# EAGLE design v1.3 (EAGLE 9.4.2)
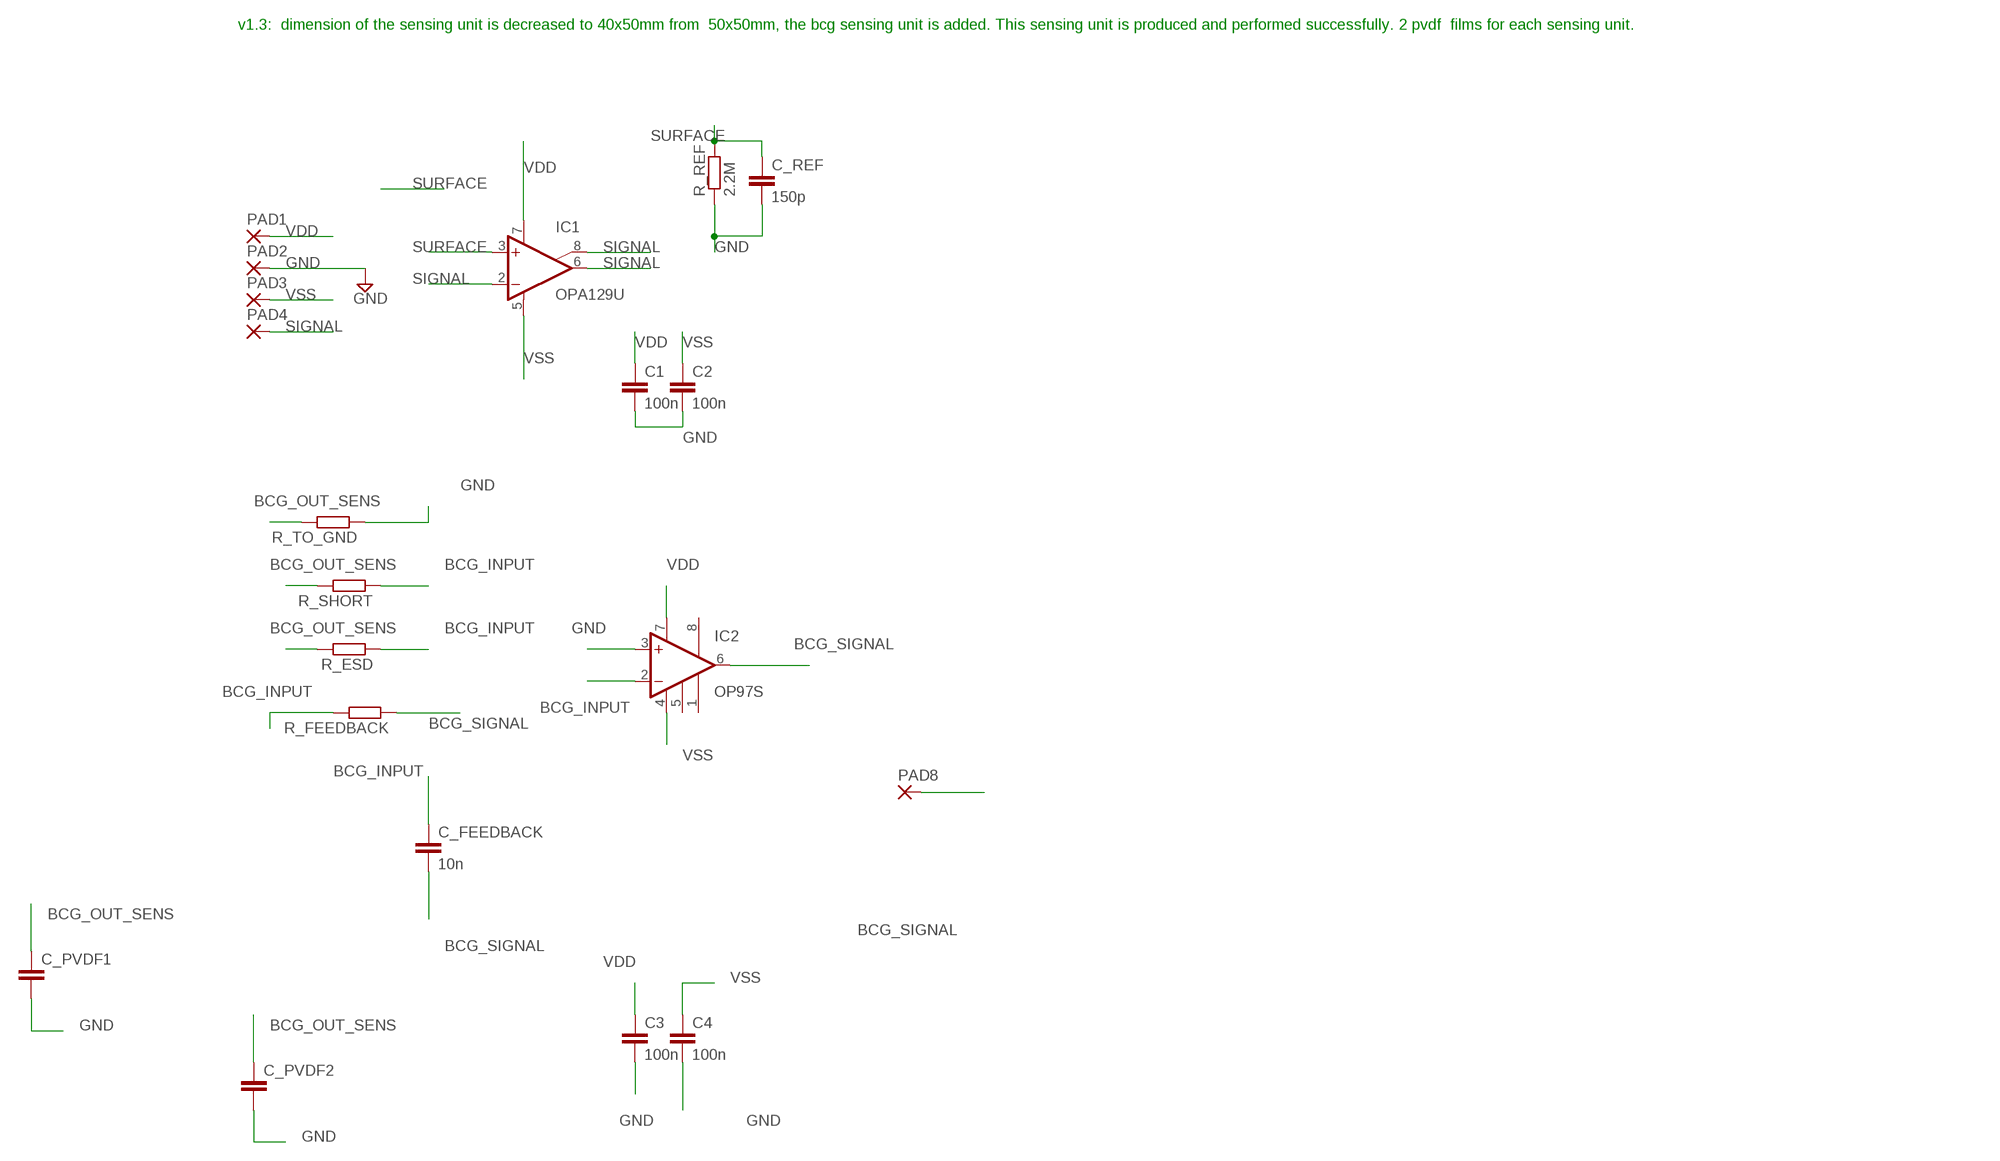
[diagram p0: schematic, sheet 1]

## Parts
C1  100n  C-EUC0805  [C0805]
C2  100n  C-EUC0805  [C0805]
C3  100n  C-EUC0805  [C0805]
C4  100n  C-EUC0805  [C0805]
C_FEEDBACK  10n  C-EUC0805  [C0805]
C_PVDF1  C-EUC0805  [C0805]
C_PVDF2  C-EUC0805  [C0805]
C_REF  150p  C-EUC0805  [C0805]
IC1  OPA129U  [SO08]
IC2  OP97S  [SO08]
PAD1  SMD5  [SMD2,54-5,08]
PAD2  SMD5  [SMD2,54-5,08]
PAD3  SMD5  [SMD2,54-5,08]
PAD4  SMD5  [SMD2,54-5,08]
PAD8  SMD5  [SMD2,54-5,08]
R_ESD  1M  R-EU_M0805  [M0805]
R_FEEDBACK  100M  R-EU_M0805  [M0805]
R_REF  2.2M  R-EU_M0805  [M0805]
R_SHORT  1M  R-EU_M0805  [M0805]
R_TO_GND  1M  R-EU_M0805  [M0805]

## Nets
BCG_INPUT: C_FEEDBACK.1 IC2.2(-IN) R_ESD.1 R_FEEDBACK.2 R_SHORT.1
BCG_OUT_SENS: C_PVDF1.1 C_PVDF2.1 R_ESD.2 R_SHORT.2 R_TO_GND.2
BCG_SIGNAL: C_FEEDBACK.2 IC2.6(OUT) PAD8.1(P) R_FEEDBACK.1
GND: C1.2 C2.2 C3.2 C4.2 C_PVDF1.2 C_PVDF2.2 C_REF.2 IC2.3(+IN) PAD2.1(P) R_REF.1 R_TO_GND.1
SIGNAL: IC1.2(-IN) IC1.6(OUT) IC1.8(SUBS) PAD4.1(P)
SURFACE: C_REF.1 IC1.3(+IN) R_REF.2
VDD: C1.1 C3.1 IC1.7(V+) IC2.7(V+) PAD1.1(P)
VSS: C2.1 C4.1 IC1.5(V-) IC2.4(V-) PAD3.1(P)
Unconnected: IC2.1(BAL1) IC2.5(COMP) IC2.8(BAL2)

## Notes on the sheet
- v1.3:  dimension of the sensing unit is decreased to 40x50mm from  50x50mm, the bcg sensing unit is added. This sensing unit is produced and performed successfully. 2 pvdf  films for each sensing unit.

## Library data of the parts
C1-C4 C_REF = resistor:C-EU: CAPACITOR, European symbol
C_FEEDBACK C_PVDF1 C_PVDF2 = rcl:C-EU: CAPACITOR, European symbol; SPICEPREFIX: C
IC1 = burr-brown:OPA129: Difet Operational Amplifier Ultra-Low Bias Current; MF: TEXAS INSTRUMENTS; MPN: OPA129U; OC_FARNELL: 1206925; OC_NEWARK: 80K6004
IC2 = linear:OP97: Low Power, High Precision Operational Amplifier Source: http://www.analog.com/static/imported-files/data_sheets/OP97.pdf
PAD1-PAD4 PAD8 = wirepad:SMD5: SMD PAD
R_ESD R_FEEDBACK R_REF R_SHORT R_TO_GND = rcl:R-EU_: RESISTOR, European symbol; SPICEPREFIX: R

## Board
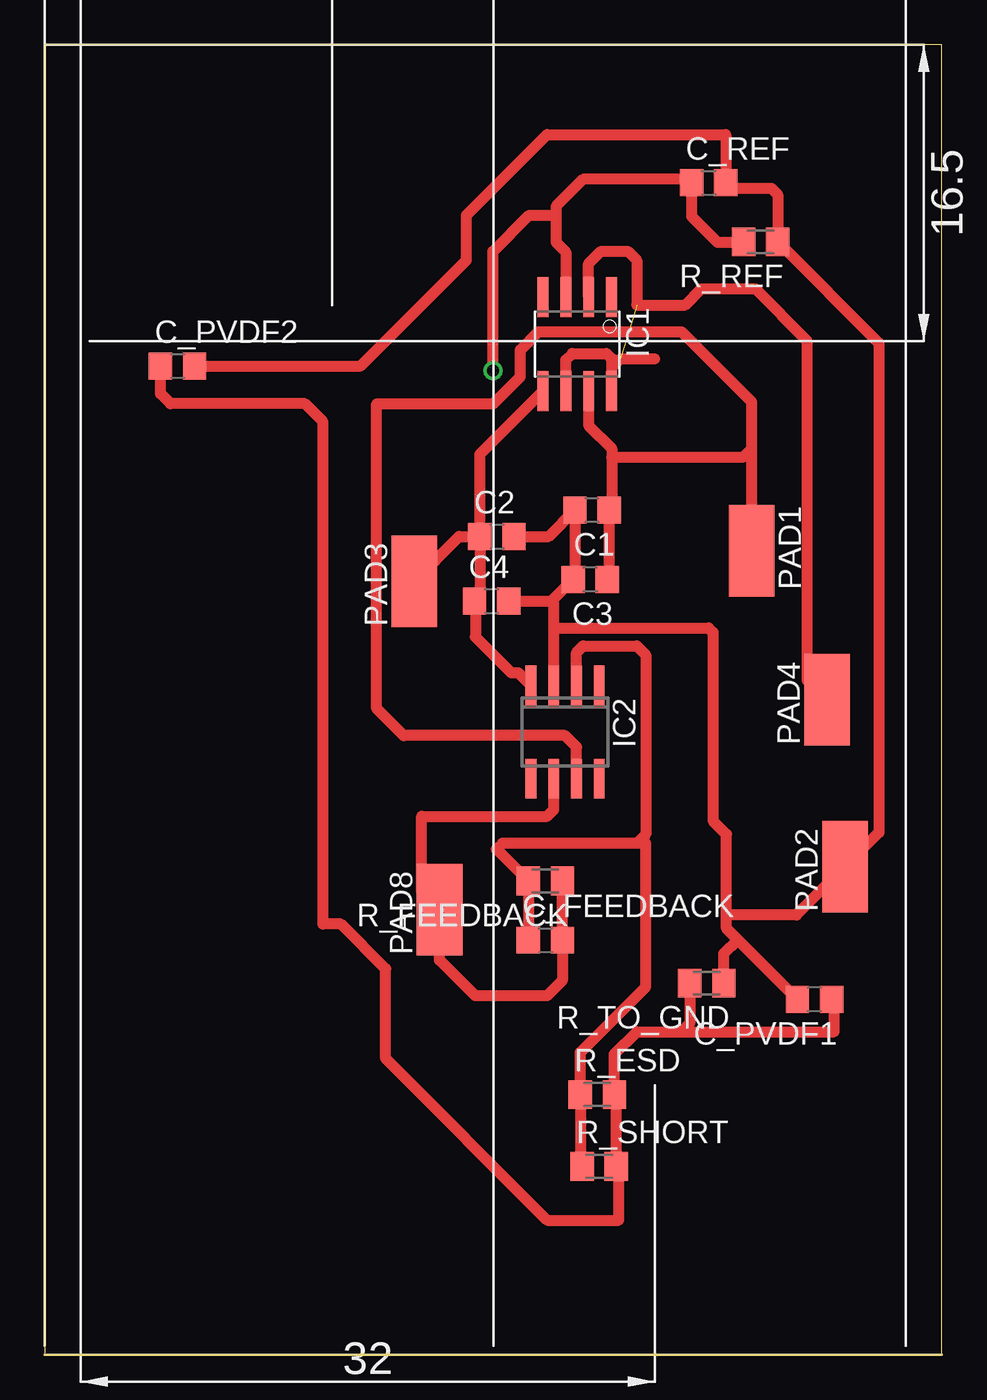
[diagram p1: board, top side]
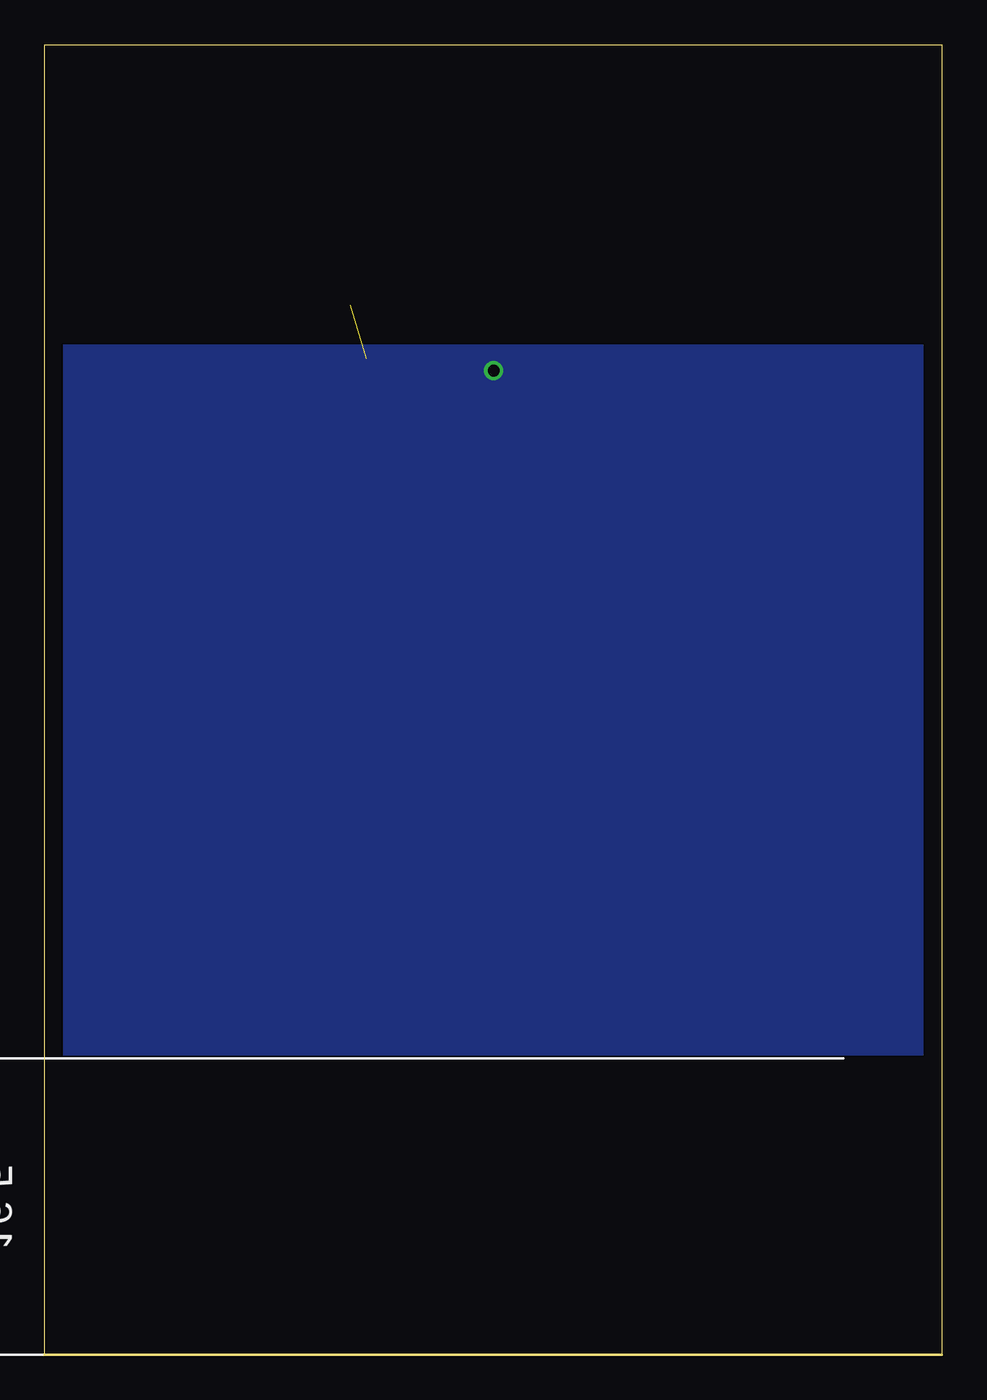
[diagram p2: board, bottom side, seen from below]

Size 50 x 73 mm. Coordinates in mm from the lower left corner, seen from the top.
Outline: 50,0 50,73 0,73 0,0 50,0
Copper layers (1*16): Top 0.035mm / dielectric 1.5mm / Bottom 0.035mm
Design rules "TM_medit_aetzen": minimum track width 10mil, minimum drill 8mil, track to track 10mil, track to pad 10mil, pad to pad 10mil, via to via 15mil, smd to smd 8mil, copper to edge 40mil, drill to drill 8mil, minimum pad ring 10mil, minimum via ring 8mil, stop-mask expansion 4mil, vias tented up to drill 0mil, thermal gap 10mil

### Footprints (pad centres in the part's own frame; a part is rotated, then mirrored left to right if it is on the bottom)
C0805 = smd 1.3 x 1.5: 1 -0.95,0; 2 0.95,0
SO08 = smd 0.61 x 2.21: 1 -1.905,-2.616; 2 -0.635,-2.616; 3 0.635,-2.616; 4 1.905,-2.616; 5 1.905,2.616; 6 0.635,2.616; 7 -0.635,2.616; 8 -1.905,2.616
SO08' = smd 0.6 x 2.2: 1 -1.905,-2.6; 2 -0.635,-2.6; 3 0.635,-2.6; 4 1.905,-2.6; 5 1.905,2.6; 6 0.635,2.6; 7 -0.635,2.6; 8 -1.905,2.6
SMD2,54-5,08 = smd 2.54 x 5.08: 1 0,0
M0805 = smd 1.3 x 1.6: 1 -0.95,0; 2 0.95,0

### Placement (x,y rotation side)
C1  30.5,47.06 180 top
C2  25.2,45.6 0 top
C3  30.4,43.2 180 top
C4  24.9,42 0 top
C_FEEDBACK  27.9,23.1 0 top
C_PVDF1  42.9,19.8 180 top
C_PVDF2  7.4,55.1 0 top
C_REF  37,65.31 0 top
IC1  29.68,56.32 180 top
IC2  OP97S  [SO08']  29,34.7 180 top
PAD1  39.4,44.8 180 top
PAD2  44.6,27.2 0 top
PAD3  20.6,43.1 0 top
PAD4  43.6,36.5 0 top
PAD8  22,24.8 0 top
R_ESD  30.8,14.5 0 top
R_FEEDBACK  27.9,26.4 180 top
R_REF  39.9,62.02 180 top
R_SHORT  30.9,10.5 0 top
R_TO_GND  36.9,20.7 180 top

### Tracks (layer width: path | path; a pad name or v marks a point on that pad's centre or on a via)
BCG_INPUT
  Top 0.61: C_FEEDBACK.1 R_FEEDBACK.2 25.18,28.18 25.5,28.5 33,28.5 | 33,28.5 33.5,28.5 33.5,20.5 29.85,16.85 R_ESD.1 29.85,10.6 R_SHORT.1 | IC2.2 29.64,39.13 30,39.5 33,39.5 33.5,39 33.5,29 33,28.5
BCG_OUT_SENS
  Top 0.61: 35.5,18 33,18 31.75,16.75 R_ESD.2 31.85,14.4 R_SHORT.2 32,10.35 32,7.5 28,7.5 19,16.5 19,21.5 16.5,24 15.5,24 15.5,52 14.5,53 7,53 6.45,53.55 C_PVDF2.1 | 35.5,18 44,18 44,19.65 C_PVDF1.1 | R_TO_GND.2 35.95,18.45 35.5,18
BCG_SIGNAL
  Top 0.61: R_FEEDBACK.1 C_FEEDBACK.2 28.85,20.85 28,20 24,20 22,22 PAD8.1 21,25.8 21,30 28,30 28.36,30.36 IC2.6
GND
  Top 0.61: 28.25,42 C3.2 29.55,43.3 C1.2 28.09,45.6 C2.2 | C4.2 28.25,42 | C_PVDF1.2 38.62,23.12 | 38.62,23.12 38,23.75 38,24.5 | 38,24.5 38,29 37.25,29.75 37.25,40.25 37,40.5 28.36,40.5 | R_TO_GND.1 37.85,22.35 38.62,23.12 | C_PVDF2.2 17.6,55.1 23.5,61 23.5,63.5 28,68 37.95,68 C_REF.2 38.26,65 40.5,65 40.85,64.65 R_REF.1 46.5,56.37 46.5,29.1 PAD2.1 41.9,24.5 38,24.5 | 28.25,42 28.36,41.88 28.36,40.5 | 28.36,40.5 IC2.3
SIGNAL  (1 unrouted)
  Top 0.61: IC1.6 29.05,55.45 29.4,55.8 31.3,55.8 31.59,55.52 31.59,55 | 31.59,55 IC1.8 | 43.5,36.6 PAD4.1 42.5,37.6 42.5,56.5 39.6,59.4 36.6,59.4 35.7,58.5 33,58.5 33,61 32.5,61.5 31,61.5 30.32,60.81 IC1.2 | 31.59,55 32.09,55.5 34,55.5
SURFACE  (via drill 0.65)
  Top 0.61: IC1.3 29.05,61.45 28.5,62 28.5,63.5 | 28.5,63.5 28.5,64 30,65.5 35.86,65.5 C_REF.1 36.05,63.45 37.5,62 38.93,62 R_REF.2 | 28.5,63.5 27,63.5 24.98,61.48 v24.98,54.84
  pour Bottom (isolate 0.305): 0.5,56 49.5,56 49.5,17 0.5,17
VDD
  Top 0.61: 31.6,50 31.6,50.5 30.32,51.78 IC1.7 | 31.6,50 31.6,47.21 C1.1 31.45,43.3 C3.1 | IC2.7 29.64,33.87 29,34.5 20,34.5 18.5,36 18.5,53 25,53 26.5,54.5 26.5,56 27.5,57 35.5,57 39.4,53.1 39.4,50.5 | PAD1.1 39.4,50.5 | 39.4,50.5 38.9,50 31.6,50
VSS
  Top 0.61: C2.1 24.25,50.18 IC1.5 | C2.1 24.25,42.3 C4.1 24,41.95 24,40 26,38 26.39,38 IC2.4 | PAD3.1 23.1,45.6 C2.1